# EasyEDA Pro project ProProject_BM3451[四串锂电池保护板]_2024-07-04.epro

# Schematic BM3415
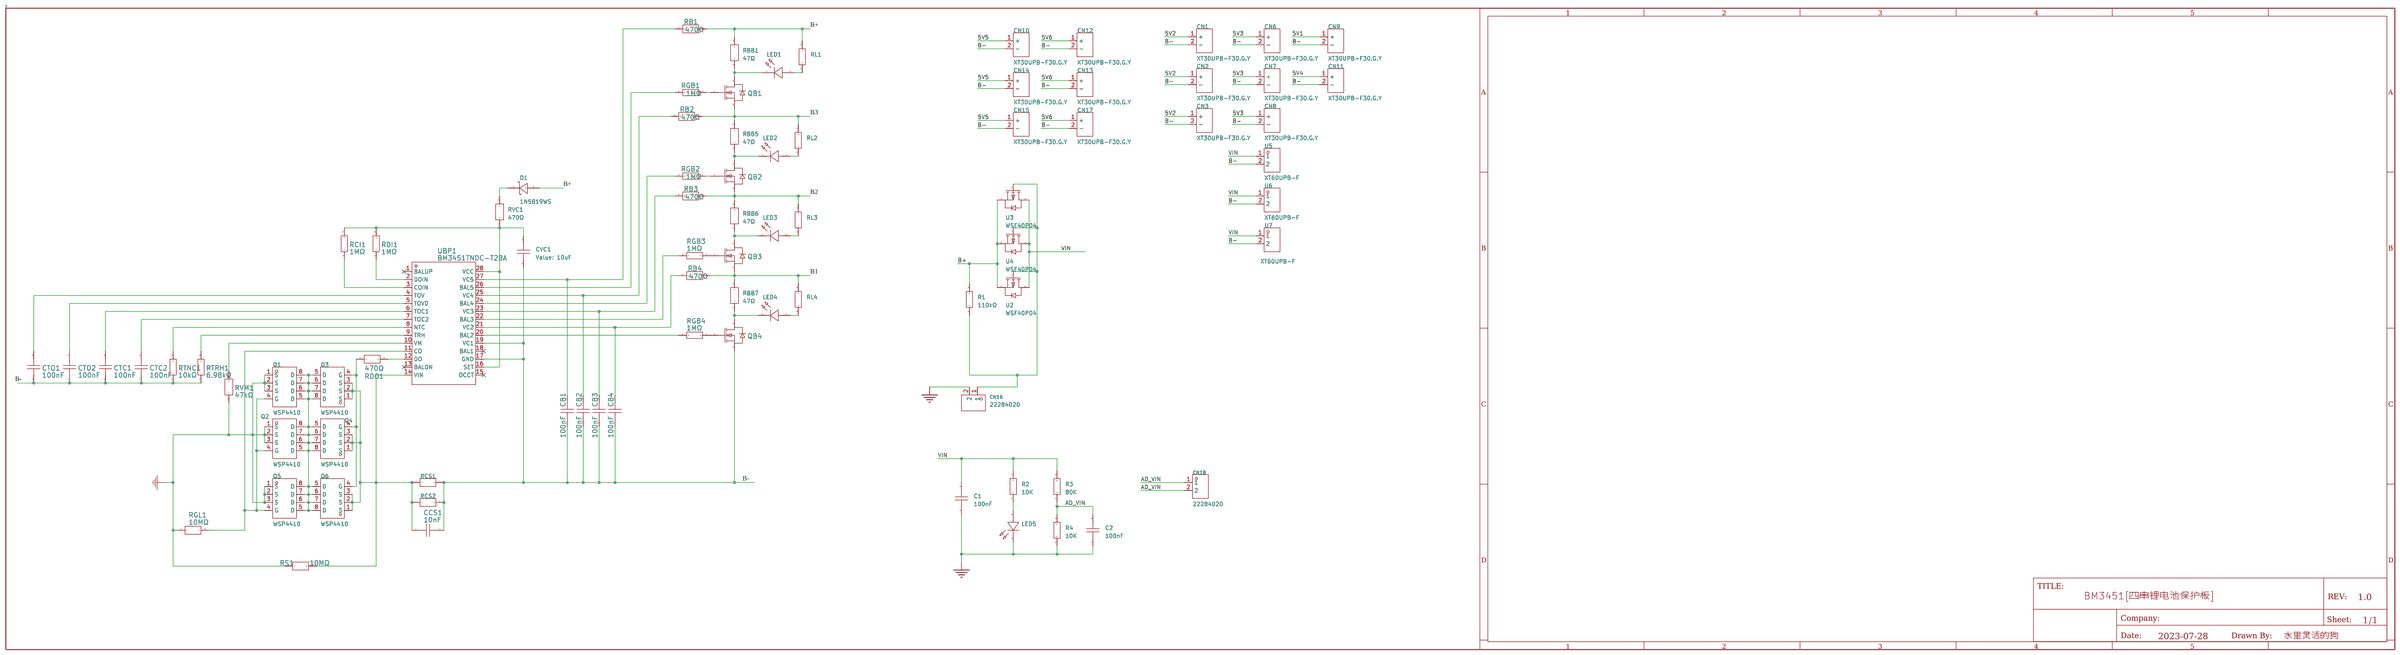
[diagram p0: schematic sheet]

## Parts
C1  100nF  [C0805]
C2  100nF  [C0805]
CB1  100nF  [C0805]
CB2  100nF  [C0805]
CB3  100nF  [C0805]
CB4  100nF  [C0805]
CCS1  10nF  [C0805]
CN1  XT30UPB-F30.G.Y  [CONN-TH_XT30UPB-F]
CN2  XT30UPB-F30.G.Y  [CONN-TH_XT30UPB-F]
CN3  XT30UPB-F30.G.Y  [CONN-TH_XT30UPB-F]
CN6  XT30UPB-F30.G.Y  [CONN-TH_XT30UPB-F]
CN7  XT30UPB-F30.G.Y  [CONN-TH_XT30UPB-F]
CN8  XT30UPB-F30.G.Y  [CONN-TH_XT30UPB-F]
CN9  XT30UPB-F30.G.Y  [CONN-TH_XT30UPB-F]
CN10  XT30UPB-F30.G.Y  [CONN-TH_XT30UPB-F]
CN11  XT30UPB-F30.G.Y  [CONN-TH_XT30UPB-F]
CN12  XT30UPB-F30.G.Y  [CONN-TH_XT30UPB-F]
CN13  XT30UPB-F30.G.Y  [CONN-TH_XT30UPB-F]
CN14  XT30UPB-F30.G.Y  [CONN-TH_XT30UPB-F]
CN15  XT30UPB-F30.G.Y  [CONN-TH_XT30UPB-F]
CN16  22284020  [HDR-TH_2P-P2.54-V-M-1]
CN17  XT30UPB-F30.G.Y  [CONN-TH_XT30UPB-F]
CN18  22284020  [HDR-TH_2P-P2.54-V-M-1]
CTC1  100nF  [C0805]
CTC2  100nF  [C0805]
CTO1  100nF  [C0805]
CTO2  100nF  [C0805]
CVC1  10uF  [C0805]
D1  1N5819WS  [SOD-323_L1.8-W1.3-LS2.5-RD]
LED1  XL-1005UGC  [LED0805-RD]
LED2  XL-1005UGC  [LED0805-RD]
LED3  XL-1005UGC  [LED0805-RD]
LED4  XL-1005UGC  [LED0805-RD]
LED5  XL-1005UGC  [LED0805-RD]
Q1  WSP4410  [SOIC-8_L4.9-W3.9-P1.27-LS6.0-BL]
Q2  WSP4410  [SOIC-8_L4.9-W3.9-P1.27-LS6.0-BL]
Q3  WSP4410  [SOIC-8_L4.9-W3.9-P1.27-LS6.0-BL]
Q4  WSP4410  [SOIC-8_L4.9-W3.9-P1.27-LS6.0-BL]
Q5  WSP4410  [SOIC-8_L4.9-W3.9-P1.27-LS6.0-BL]
Q6  WSP4410  [SOIC-8_L4.9-W3.9-P1.27-LS6.0-BL]
QB1  2N7002  [SOT-23-3_L2.9-W1.3-P1.90-LS2.4-BR]
QB2  2N7002  [SOT-23-3_L2.9-W1.3-P1.90-LS2.4-BR]
QB3  2N7002  [SOT-23-3_L2.9-W1.3-P1.90-LS2.4-BR]
QB4  2N7002  [SOT-23-3_L2.9-W1.3-P1.90-LS2.4-BR]
R1  110kΩ  [R0805]
R2  10K  [R0805]
R3  80K  [R0805]
R4  10K  [R0805]
RB1  470Ω  [R0805]
RB2  470Ω  [R0805]
RB3  470Ω  [R0805]
RB4  470Ω  [R0805]
RBB1  47Ω  [R2512]
RBB5  47Ω  [R2512]
RBB6  47Ω  [R2512]
RBB7  47Ω  [R2512]
RCI1  1MΩ  [R0805]
RCS1  5mΩ  [R2512]
RCS2  5mΩ  [R2512]
RDI1  1MΩ  [R0805]
RDO1  470Ω  [R0805]
RGB1  1MΩ  [R0805]
RGB2  1MΩ  [R0805]
RGB3  1MΩ  [R0805]
RGB4  1MΩ  [R0805]
RGL1  10MΩ  [R0805]
RL1  100Ω  [R0805]
RL2  100Ω  [R0805]
RL3  100Ω  [R0805]
RL4  100Ω  [R0805]
RS1  10MΩ  [R0805]
RTNC1  10kΩ  [R0805]
RTRH1  6.98kΩ  [R0805]
RVC1  470Ω  [R0805]
RVM1  47kΩ  [R0805]
U2  WSF40P04  [TO-252-3_L6.5-W5.8-P4.58-TL]
U3  WSF40P04  [TO-252-3_L6.5-W5.8-P4.58-TL]
U4  WSF40P04  [TO-252-3_L6.5-W5.8-P4.58-TL]
U5  XT60UPB-F  [CONN-TH_XT60UPB-F]
U6  XT60UPB-F  [CONN-TH_XT60UPB-F]
U7  XT60UPB-F  [CONN-TH_XT60UPB-F]
UBP1  BM3451TNDC-T28A  [TSSOP-28_L9.7-W4.4-P0.65-LS6.4-BL]  (no BOM)

## Library data of the parts
C1 C2 = CAP_0603: Supplier Footprint: 0603
CB1-CB4 CTC1 CTC2 CTO1 CTO2 = GRM155R71H104KE14D: 容值:100nF;精度:±10%;额定电压:50V;材质(温度系数):X7R;; LCSC Part Name: 100nF ±10% 50V; Supplier Part: C77020; Manufacturer: muRata(村田); Supplier Footprint: 0402; JLCPCB Part Class: Extended Part; Datasheet: https://atta.szlcsc.com/upload/public/pdf/source/20180326/C77020_39BD49C951FF1AF0DB1F1FAC5AC1E401.pdf; Supplier: LCSC; Tolerance: ±10%; Voltage Rated: 50V; Temperature Coefficient: X7R
CCS1 = C0402C103K4RECAUTO: 容值:10nF;精度:±10%;额定电压:16V;材质(温度系数):X7R;; LCSC Part Name: 10nF ±10% 16V; Supplier Part: C696351; Manufacturer: KEMET(基美); Supplier Footprint: 0402; JLCPCB Part Class: Extended Part; Datasheet: https://atta.szlcsc.com/upload/public/pdf/source/20200618/C599854_9A7AFD29568EF40FC359C8C28B3F53DB.pdf; Supplier: LCSC; Tolerance: ±10%; Voltage Rated: 16V; Temperature Coefficient: X7R
CN1-CN3 CN6-CN15 CN17 = XT30UPB-F30.G.Y: 类别:-;类型1:-;; LCSC Part Name: AMASS(艾迈斯)直立焊板式连接器XT30UPB30-F.G.*; Supplier Part: C108769; Manufacturer: AMASS(艾迈斯); JLCPCB Part Class: 扩展库; Datasheet: https://atta.szlcsc.com/upload/public/pdf/source/20220715/AFD68B9E8B6CA95A7295DBF4AF9325E4.pdf; Supplier: LCSC; Brand: 艾迈斯; Type: 航模插头; Colour: 黄色; RatedVoltage: DC 500V; InterfaceType: 母头; MetalMaterial: 镀金; InsulationMaterial: PA; RatedCurrent: 15A; contact resistance: 0.65mΩ
CN16 CN18 = 22284020: 排数:单排;总PIN位数:2;间距:2.54mm;插针结构:1x2P;行距:-;安装类型:直插;圆针/方针:方针;额定电流:-;额定电压:-;配合针长度:-;塑高:-;触头材质:黄铜;触头镀层:-;颜色:黑色;; LCSC Part Name: 2.54mm 1x2P 直插 方针; Supplier Part: C234182; Manufacturer: MOLEX; Supplier Footprint: 直插,P=2.54mm; JLCPCB Part Class: Extended Part; Supplier: LCSC; Number of Rows: 单排; Number of Pins: 2; Pitch: 2.54mm; Pin Structure: 1x2P; Mounting Type: 直插; Circluar Pins/Square Pins: 方针; Contact Material: 黄铜; Color: 黑色
CVC1 = GRM188R61E106KA73D: 容值:10uF;精度:±10%;额定电压:25V;材质(温度系数):X5R;; LCSC Part Name: 10uF ±10% 25V; Supplier Part: C344022; Manufacturer: muRata(村田); Supplier Footprint: 0603; JLCPCB Part Class: 扩展库; Datasheet: https://atta.szlcsc.com/upload/public/pdf/source/20181211/C344022_BB98D43E7DA95E5A749FBFE073C8A3E0.pdf; Supplier: LCSC; Tolerance: ±10%; Voltage Rated: 25V; Temperature Coefficient: X5R
D1 = 1N5819WS_C191023: 正向压降(Vf):600mV@1A;直流反向耐压(Vr):40V;平均整流电流(Io):1A;; LCSC Part Name: 电压:40V 电流:1A; Supplier Part: C191023; Manufacturer: Hottech(合科泰); Supplier Footprint: SOD-323; JLCPCB Part Class: 基础库; Datasheet: https://atta.szlcsc.com/upload/public/pdf/source/20220428/3CB86FD8D28D653594B4E35F9D5AEFD9.pdf; Supplier: LCSC; Forward Voltage (Vf@If): 600mV@1A; Reverse Voltage (Vr): 40V; Average Rectified Current (Io): 1A
LED1-LED5 = XL-1005UGC: 发光颜色:翠绿;主波长:516nm;色温:-;功率:80mW;安装方式:正贴;; LCSC Part Name: 正贴; Supplier Part: C2856703; Manufacturer: XINGLIGHT(成兴光); Supplier Footprint: 0402; JLCPCB Part Class: 扩展库; Datasheet: https://atta.szlcsc.com/upload/public/pdf/source/20221102/FF8D6BC2225363A60A01D46BB802F217.pdf; Supplier: LCSC; Emitted Color: 翠绿; Lens Color: 无色透明; Dominant Wavelength: 516nm; Peak Wavelength: 531nm; Forward Current: 25mA; Power Dissipation: 80mW; Viewing Angle: 120°; Mounting Sytle: 正贴; Operating Temperature: -30℃~+85℃
Q1-Q6 = WSP4410: 类型:1个N沟道;漏源电压(Vdss):30V;连续漏极电流(Id):20A;功率(Pd):4.2W;导通电阻(RDS(on)@Vgs,Id):5.5mΩ@10V,20A;阈值电压(Vgs(th)@Id):2.5V@250uA;; LCSC Part Name: 1个N沟道 耐压:30V 电流:20A; Supplier Part: C148401; Manufacturer: WINSOK(微硕); Supplier Footprint: SOIC-8; JLCPCB Part Class: 扩展库; Datasheet: https://atta.szlcsc.com/upload/public/pdf/source/20171122/C148401_15113334083791134046.pdf; Supplier: LCSC; Type: 1个N沟道; Drain Source Voltage (Vdss): 30V; Continuous Drain Current (Id): 20A; Power Dissipation (Pd): 4.2W; Drain Source On Resistance (RDS(on)@Vgs,Id): 5.5mΩ@10V,20A; Gate Threshold Voltage (Vgs(th)@Id): 2.5V@250uA
QB1-QB4 = 2N7002_C8545: 类型:N沟道;漏源电压(Vdss):60V;连续漏极电流(Id):115mA;功率(Pd):200mW;导通电阻(RDS(on)@Vgs,Id):7.5Ω@10V,500mA;阈值电压(Vgs(th)@Id):2.5V@250uA;; LCSC Part Name: N沟道 60V 115mA; Supplier Part: C8545; Manufacturer: CJ(江苏长电/长晶); Supplier Footprint: SOT-23; JLCPCB Part Class: Basic Part; Datasheet: https://atta.szlcsc.com/upload/public/pdf/source/20170302/1488422688078.pdf; Supplier: LCSC; Type: N沟道; Drain Source Voltage (Vdss): 60V; Continuous Drain Current (Id): 115mA; Power Dissipation (Pd): 200mW; Drain Source On Resistance (RDS(on)@Vgs,Id): 7.5Ω@10V,500mA; Gate Threshold Voltage (Vgs(th)@Id): 2.5V@250uA; image: //image.lceda.cn/szlcsc/C8545.jpg
R1 = 0805W8F5601T5E: 电阻类型:厚膜电阻;阻值:5.6kΩ;精度:±1%;功率:125mW;最大工作电压:150V;温度系数:±100ppm/℃;; LCSC Part Name: 5.6kΩ ±1% 125mW 厚膜电阻; Supplier Part: C4382; Manufacturer: UNI-ROYAL(厚声); Supplier Footprint: 0805; JLCPCB Part Class: 基础库; Datasheet: https://atta.szlcsc.com/upload/public/pdf/source/20200306/C422600_1E6D84923E4A46A82E41ADD87F860B5C.pdf; Supplier: LCSC; Type: 厚膜电阻; Tolerance: ±1%; Power(Watts): 125mW; Overload Voltage (Max): 150V; Temperature Coefficient: ±100ppm/℃; Operating Temperature Range: -55℃~+155℃
R2-R4 = Res_0603: Supplier Footprint: 0603
RB1-RB4 RDO1 = AC0402FR-07470RL: 电阻类型:厚膜电阻;阻值:470Ω;精度:±1%;功率:62.5mW;; LCSC Part Name: 470Ω ±1% 62.5mW; Supplier Part: C227095; Manufacturer: YAGEO(国巨); Supplier Footprint: 0402; JLCPCB Part Class: Extended Part; Supplier: LCSC; Type: 厚膜电阻; Tolerance: ±1%; Power(Watts): 62.5mW; Temperature Coefficient: ±100ppm/℃; Overload Voltage (Max): 50V; Operating Temperature Range: -55℃~+155℃
RBB1 RBB5-RBB7 = RC-12K47R0FT: 阻值:47Ω;精度:±1%;功率:1W;; LCSC Part Name: 47Ω ±1% 1W; Supplier Part: C454019; Manufacturer: FH(风华); Supplier Footprint: 2512; JLCPCB Part Class: 扩展库; Datasheet: https://atta.szlcsc.com/upload/public/pdf/source/20191118/C454019_423B00CEBAB54B2627AFCDB1F4844184.pdf; Supplier: LCSC; Tolerance: ±1%; Power(Watts): 1W; Temperature Coefficient: ±100ppm/℃; Overload Voltage (Max): 200V; Operating Temperature Range: -55℃~+155℃
RCI1 RDI1 RGB1-RGB4 = RMC04021M1%N: 阻值:1MΩ;精度:±1%;功率:62.5mW;; LCSC Part Name: 1MΩ ±1% 62.5mW; Supplier Part: C269676; Manufacturer: Tyohm(幸亚电阻); Supplier Footprint: 0402; JLCPCB Part Class: Extended Part; Datasheet: https://atta.szlcsc.com/upload/public/pdf/source/20190115/C269676_B2C26B8F3189207BFE78006A6224644A.pdf; Supplier: LCSC; Tolerance: ±1%; Power(Watts): 62.5mW
RCS1 RCS2 = RLP25FEGR010: 阻值:10mΩ;精度:±1%;功率:3W;; LCSC Part Name: 10mΩ ±1% 3W; Supplier Part: C393070; Manufacturer: 大毅科技; Supplier Footprint: 2512; JLCPCB Part Class: 扩展库; Datasheet: https://atta.szlcsc.com/upload/public/pdf/source/20190614/C393070_2745FAF1A0F67D16246ACC5358362128.pdf; Supplier: LCSC; Tolerance: ±1%; Power(Watts): 3W; Temperature Coefficient: ±50ppm/℃
RGL1 RS1 = CQ02WGF1005TCE: 阻值:10MΩ;精度:±1%;功率:62.5mW;; LCSC Part Name: 10MΩ ±1% 62.5mW; Supplier Part: C966881; Manufacturer: UNI-ROYAL(厚声); Supplier Footprint: 0402; JLCPCB Part Class: Extended Part; Datasheet: https://atta.szlcsc.com/upload/public/pdf/source/20191220/C473620_6C11B82F3C06B184C34B0BC4B16C3771.pdf; Supplier: LCSC; Tolerance: ±1%; Power(Watts): 62.5mW; Temperature Coefficient: ±100ppm/℃
RL1-RL4 = 0402WGF1000TCE: 电阻类型:厚膜电阻;阻值:100Ω;精度:±1%;功率:62.5mW;; LCSC Part Name: 100Ω ±1% 62.5mW; Supplier Part: C25076; Manufacturer: UNI-ROYAL(厚声); Supplier Footprint: 0402; JLCPCB Part Class: 基础库; Datasheet: https://atta.szlcsc.com/upload/public/pdf/source/20200306/C422600_1E6D84923E4A46A82E41ADD87F860B5C.pdf; Supplier: LCSC; Type: 厚膜电阻; Tolerance: ±1%; Power(Watts): 62.5mW; Temperature Coefficient: ±200ppm/℃; Overload Voltage (Max): 50V; Operating Temperature Range: -55℃~+155℃
RTNC1 = HQ02WAJ0103TCE: 阻值:10kΩ;精度:±5%;功率:100mW;; LCSC Part Name: 10kΩ ±5% 100mW; Supplier Part: C414854; Manufacturer: UNI-ROYAL(厚声); Supplier Footprint: 0402; JLCPCB Part Class: Extended Part; Datasheet: https://atta.szlcsc.com/upload/public/pdf/source/20190827/C414854_F9DF8C7611D3E333A8C36E68C956CEBE.pdf; Supplier: LCSC; Tolerance: ±5%; Power(Watts): 100mW; Temperature Coefficient: ±100ppm/℃; Overload Voltage (Max): 50V; Operating Temperature Range: -55℃~+155℃
RTRH1 = 0402WGF6981TCE: 电阻类型:厚膜电阻;阻值:6.98kΩ;精度:±1%;功率:62.5mW;; LCSC Part Name: 6.98kΩ ±1% 62.5mW; Supplier Part: C47500; Manufacturer: UNI-ROYAL(厚声); Supplier Footprint: 0402; JLCPCB Part Class: Extended Part; Datasheet: https://atta.szlcsc.com/upload/public/pdf/source/20200306/C422600_1E6D84923E4A46A82E41ADD87F860B5C.pdf; Supplier: LCSC; Type: 厚膜电阻; Tolerance: ±1%; Power(Watts): 62.5mW; Temperature Coefficient: ±100ppm/℃; Overload Voltage (Max): 50V; Operating Temperature Range: -55℃~+155℃
RVC1 = AC0402FR-07470RL: 电阻类型:厚膜电阻;阻值:470Ω;精度:±1%;功率:62.5mW;; LCSC Part Name: 470Ω ±1% 62.5mW; Supplier Part: C227095; Manufacturer: YAGEO(国巨); Supplier Footprint: 0402; JLCPCB Part Class: 扩展库; Supplier: LCSC; Type: 厚膜电阻; Tolerance: ±1%; Power(Watts): 62.5mW; Temperature Coefficient: ±100ppm/℃; Overload Voltage (Max): 50V; Operating Temperature Range: -55℃~+155℃
RVM1 = SY0402FN47KP: 电阻类型:厚膜电阻;阻值:47kΩ;精度:±1%;功率:62.5mW;; LCSC Part Name: 47kΩ ±1% 62.5mW; Supplier Part: C380741; Manufacturer: SANYEAR(叁叶源); Supplier Footprint: 0402; JLCPCB Part Class: Extended Part; Datasheet: https://atta.szlcsc.com/upload/public/pdf/source/20190402/C380741_8CF2CE0335C9F0AD9BB6891F24649840.pdf; Supplier: LCSC; Type: 厚膜电阻; Tolerance: ±1%; Power(Watts): 62.5mW; Temperature Coefficient: ±100ppm/℃; Overload Voltage (Max): 50V
U2-U4 = WSF40P04: 类型:P沟道;漏源电压(Vdss):40V;连续漏极电流(Id):20A;功率(Pd):45W;导通电阻(RDS(on)@Vgs,Id):42mΩ@10V,12A;阈值电压(Vgs(th)@Id):3V@250uA;; LCSC Part Name: P沟道 耐压:40V 电流:20A; Supplier Part: C377856; Manufacturer: WINSOK(微硕); Supplier Footprint: TO-252; JLCPCB Part Class: 扩展库; Datasheet: https://atta.szlcsc.com/upload/public/pdf/source/20190402/C377856_EA6D580CFC75EC1A86C76F055758242D.pdf; Supplier: LCSC; Type: P沟道; Drain Source Voltage (Vdss): 40V; Continuous Drain Current (Id): 20A; Power Dissipation (Pd): 45W; Drain Source On Resistance (RDS(on)@Vgs,Id): 42mΩ@10V,12A; Gate Threshold Voltage (Vgs(th)@Id): 3V@250uA
U5-U7 = XT60UPB-F: Supplier Part: C9900007500; Supplier Footprint: 插件; JLCPCB Part Class: 扩展库; Supplier: LCSC
UBP1 = BM3451UNDC-T28A: 充电电池的类型:-;电池单元组数:-;最大充电电流:-;充满的电池组电压:-;最大供应电压:-;; Supplier Part: C94597; Supplier Footprint: TSSOP-28; JLCPCB Part Class: Extended Part; Datasheet: https://atta.szlcsc.com/upload/public/pdf/source/20170417/1492393727246.pdf; Supplier: LCSC

## Nets
5V1: CN9.1(+)
5V2: CN1.1(+) CN2.1(+) CN3.1(+)
5V3: CN6.1(+) CN7.1(+) CN8.1(+)
5V4: CN11.1(+)
5V5: CN10.1(+) CN14.1(+) CN15.1(+)
5V6: CN12.1(+) CN13.1(+) CN17.1(+)
GND: CN16.2 Q1.1(S) Q1.2(S) Q1.3(S) Q2.1(S) Q2.2(S) Q2.3(S) Q5.1(S) Q5.2(S) Q5.3(S) RGL1.1 RS1.1 RVM1.1
VIN: C1.2 R2.2 R3.2 U2.2(D) U3.2(D) U4.2(D) U5.1 U6.1 U7.1
AD_VIN: C2.2 CN18.1 CN18.2 R3.1 R4.2
B1: QB3.2(S) RB4.1 RBB7.2 RL4.2
B2: QB2.2(S) RB3.1 RBB6.2 RL3.2
B3: QB1.2(S) RB2.1 RBB5.2 RL2.2
B+: D1.2(A) R1.2 RB1.1 RBB1.2 RL1.2 U2.3(S) U3.3(S) U4.3(S)
B-: C1.1 C2.1 CB1.1 CB2.1 CB3.1 CB4.1 CCS1.2 CN1.2(-) CN2.2(-) CN3.2(-) CN6.2(-) CN7.2(-) CN8.2(-) CN9.2(-) CN10.2(-) CN11.2(-) CN12.2(-) CN13.2(-) CN14.2(-) CN15.2(-) CN17.2(-) CTC1.2 CTC2.1 CTO1.1 CTO2.1 CVC1.2 LED5.1(K) QB4.2(S) R4.1 RCS1.2 RCS2.2 RTNC1.1 RTRH1.1 U5.2 U6.2 U7.2 UBP1.17(GND) UBP1.19(VC1)
$1N37: RTRH1.2 UBP1.9(TRH)
$1N38: RVM1.2 UBP1.10(VM)
$1N41: RCI1.1 UBP1.3(COIN)
$1N42: RDI1.1 UBP1.2(DOIN)
$1N54: RGB4.2 UBP1.20(BAL2)
$1N55: CB4.2 RB4.2 UBP1.21(VC2)
$1N56: RGB3.2 UBP1.22(BAL3)
$1N57: CB3.2 RB3.2 UBP1.23(VC3)
$1N58: RGB2.2 UBP1.24(BAL4)
$1N59: CB2.2 RB2.2 UBP1.25(VC4)
$1N60: RGB1.2 UBP1.26(BAL5)
$1N61: CB1.2 RB1.2 UBP1.27(VC5)
$1N66: RTNC1.2 UBP1.8(NTC)
$1N105: CTO2.2 UBP1.5(TOVD)
$1N106: CTO1.2 UBP1.4(TOV)
$1N117: CTC1.1 UBP1.6(TOC1)
$1N128: CTC2.2 UBP1.7(TOC2)
$1N197: RDO1.1 UBP1.12(DO)
$1N523: QB4.1(G) RGB4.1
$1N524: QB3.1(G) RGB3.1
$1N525: QB1.1(G) RGB1.1
$1N526: QB2.1(G) RGB2.1
$1N12807: D1.1(K) RVC1.2
$1N12811: CVC1.1 RCI1.2 RDI1.2 RVC1.1 UBP1.16(SET) UBP1.28(VCC)
$1N14828: LED3.2(A) RL3.1
$1N14831: LED3.1(K) QB3.3(D) RBB6.1
$1N14846: LED4.2(A) RL4.1
$1N14849: LED4.1(K) QB4.3(D) RBB7.1
$1N14873: LED2.2(A) RL2.1
$1N14876: LED2.1(K) QB2.3(D) RBB5.1
$1N14882: LED1.2(A) RL1.1
$1N14886: LED1.1(K) QB1.3(D) RBB1.1
$1N21594: Q1.5(D) Q1.6(D) Q1.7(D) Q1.8(D) Q2.5(D) Q2.6(D) Q2.7(D) Q2.8(D) Q3.5(D) Q3.6(D) Q3.7(D) Q3.8(D) Q4.5(D) Q4.6(D) Q4.7(D) Q4.8(D) Q5.5(D) Q5.6(D) Q5.7(D) Q5.8(D) Q6.5(D) Q6.6(D) Q6.7(D) Q6.8(D)
$1N21831: Q3.4(G) Q4.4(G) Q6.4(G) RDO1.2
$1N21844: CCS1.1 Q3.1(S) Q3.2(S) Q3.3(S) Q4.1(S) Q4.2(S) Q4.3(S) Q6.1(S) Q6.2(S) Q6.3(S) RCS1.1 RCS2.1 RS1.2 UBP1.14(VIN)
$1N22030: Q1.4(G) Q2.4(G) Q5.4(G) RGL1.2 UBP1.11(CO)
$1N23729: CN16.1 R1.1 U2.1(G) U3.1(G) U4.1(G)
$1N34990: LED5.2(A) R2.1

Not connected (* = marked no-connect by the designer): UBP1 1(BALUP)* 13(BALDN)* 15(OCCT)* 18(BAL1)*

# Board BM3415
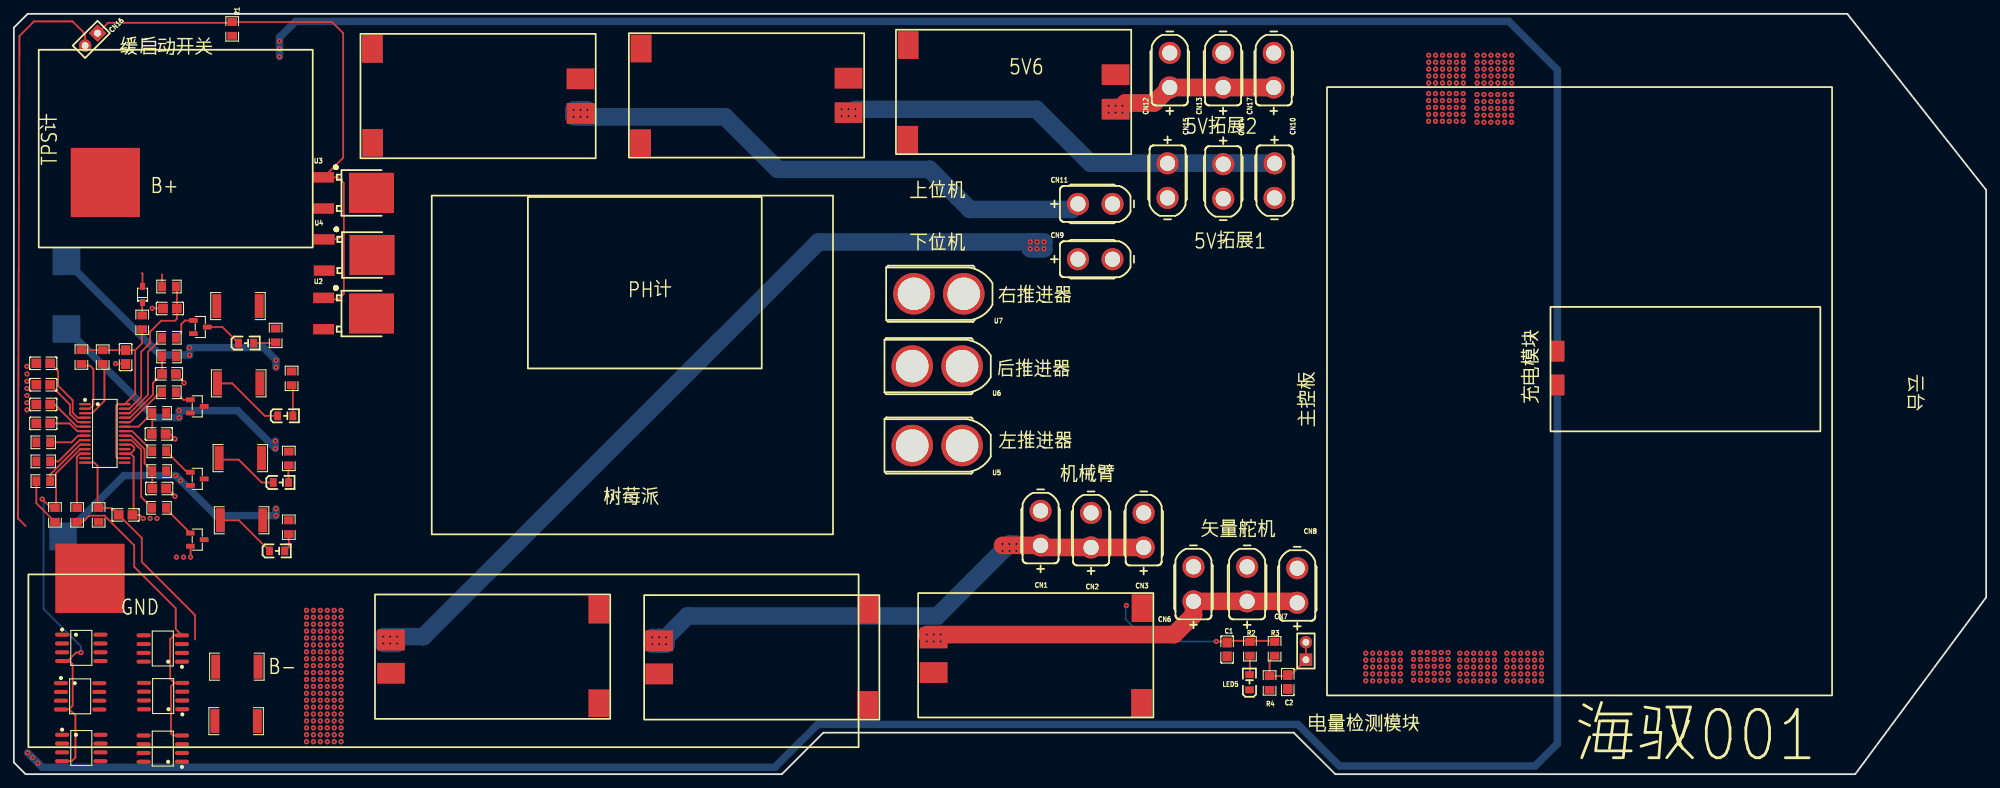
[diagram p1: board, top side]
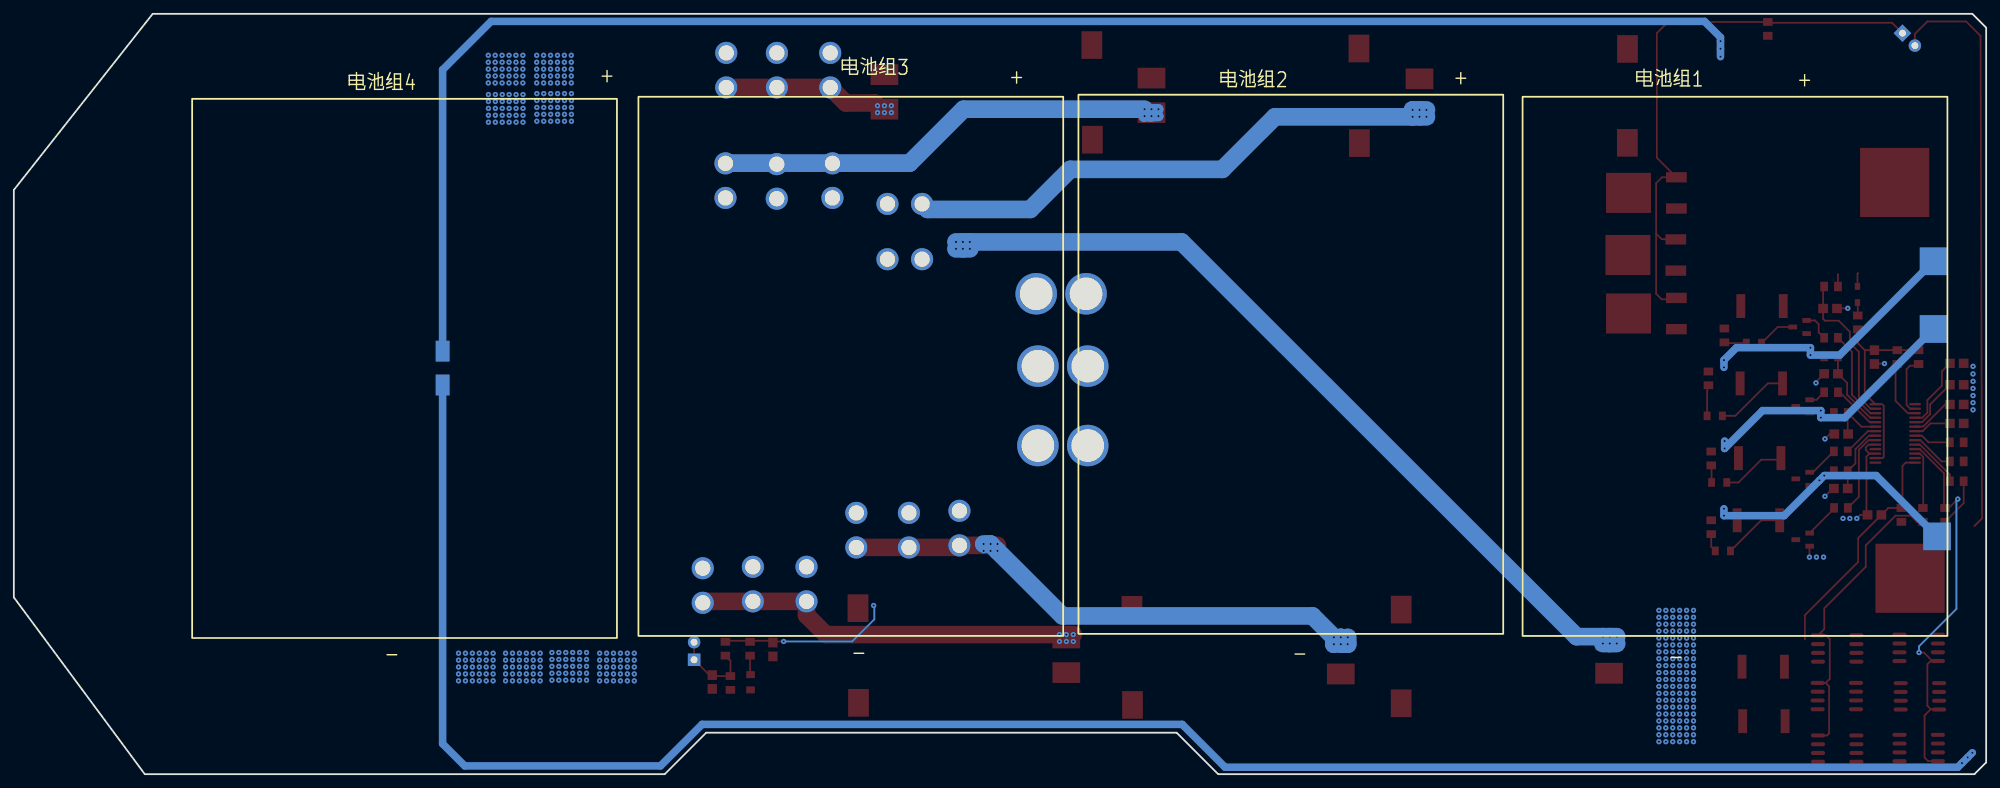
[diagram p2: board, bottom side, seen from below]

Outline 285.07 x 110 mm; copper layers: Top Layer, Bottom Layer. Coordinates in mm from the lower left corner of the outline.
Outline path: 0,108 0,1.7 1.7,0 111,0 117,6 185,6 191,0 266.14,0 285.07,25.59 285.07,84.52 265,110 2,110 0,108
Stack: Top Layer 0.035mm / Dielectric1 1.51mm FR4 er 4.5 / Bottom Layer 0.035mm

## Design rules (mm)
template: 自定义配置
spacing copperThickness1oz (default): track to track 0.102, other pairs 0.152 to 0.3
spacing copperThickness2oz: track to track 0.203, other pairs 0.152 to 0.3
track width copperThickness1oz (default): min 0.127, default 0.254, max 2.54
track width copperThickness2oz: min 0.203, default 0.254, max 2.54
differential pair differentialPair (default): width min 0.127, default 0.254, max 2.54; gap min 0.152, default 0.152
via viaSize (default): diameter min 0.5, default 0.61, max 10; hole min 0.3, default 0.305, max 6.3

## Placement (name value [footprint] x y rotation side)
C1  100nF  [C0805]  175.36 18.04 90 top
C2  100nF  [C0805]  184.12 13.33 90 top
CB1  100nF  [C0805]  22.56 67.37 0 top
CB2  100nF  [C0805]  22.42 57.92 180 top
CB3  100nF  [C0805]  20.95 49.22 180 top
CB4  100nF  [C0805]  21.01 41.33 180 top
CCS1  10nF  [C0805]  16.15 37.51 0 top
CN1  XT30UPB-F30.G.Y  [CONN-TH_XT30UPB-F]  148.4 35.6 90 top
CN2  XT30UPB-F30.G.Y  [CONN-TH_XT30UPB-F]  155.7 35.3 90 top
CN3  XT30UPB-F30.G.Y  [CONN-TH_XT30UPB-F]  163.3 35.3 90 top
CN6  XT30UPB-F30.G.Y  [CONN-TH_XT30UPB-F]  170.5 27.5 90 top
CN7  XT30UPB-F30.G.Y  [CONN-TH_XT30UPB-F]  178.25 27.5 90 top
CN8  XT30UPB-F30.G.Y  [CONN-TH_XT30UPB-F]  185.5 27.29 90 top
CN9  XT30UPB-F30.G.Y  [CONN-TH_XT30UPB-F]  156.3 74.5 0 top
CN10  XT30UPB-F30.G.Y  [CONN-TH_XT30UPB-F]  182.21 85.87 270 top
CN11  XT30UPB-F30.G.Y  [CONN-TH_XT30UPB-F]  156.3 82.5 0 top
CN12  XT30UPB-F30.G.Y  [CONN-TH_XT30UPB-F]  167.07 101.85 90 top
CN13  XT30UPB-F30.G.Y  [CONN-TH_XT30UPB-F]  174.78 101.85 90 top
CN14  XT30UPB-F30.G.Y  [CONN-TH_XT30UPB-F]  174.8 85.75 270 top
CN15  XT30UPB-F30.G.Y  [CONN-TH_XT30UPB-F]  166.75 85.87 270 top
CN16  22284020  [HDR-TH_2P-P2.54-V-M-1]  11.2 106.3 225 top
CN17  XT30UPB-F30.G.Y  [CONN-TH_XT30UPB-F]  182.1 101.85 90 top
CN18  22284020  [HDR-TH_2P-P2.54-V-M-1]  186.75 17.82 90 top
CTC1  100nF  [C0805]  4.25 53.49 180 top
CTC2  100nF  [C0805]  4.25 50.75 0 top
CTO1  100nF  [C0805]  4.25 59.44 0 top
CTO2  100nF  [C0805]  4.25 56.34 0 top
CVC1  10uF  [C0805]  16.15 60.34 270 top
D1  1N5819WS  [SOD-323_L1.8-W1.3-LS2.5-RD]  18.6 69.4 90 top
LED1  XL-1005UGC  [LED0805-RD]  33.56 62.36 0 top
LED2  XL-1005UGC  [LED0805-RD]  39.23 51.84 0 top
LED3  XL-1005UGC  [LED0805-RD]  38.59 42.2 0 top
LED4  XL-1005UGC  [LED0805-RD]  38.05 32.3 0 top
LED5  XL-1005UGC  [LED0805-RD]  178.59 13.3 90 top
NOREF  -  [Pad_e281]  93.28 19.3 90 top
NOREF#2  -  [Pad_e287]  163.06 24.01 0 top
NOREF#3  -  [Pad_e286]  132.95 14.7 90 top
NOREF#4  -  [Pad_e302]  7.6 74.2 90 top
NOREF#5  -  [Pad_e305]  7.6 64.4 90 top
NOREF#6  -  [Pad_e266]  51.86 91.33 0 top
NOREF#7  -  [Pad_e288]  162.99 10.32 0 top
NOREF#8  -  [Pad_e269]  81.9 95.6 90 top
NOREF#9  -  [Pad_e275]  120.64 100.7 90 top
NOREF#10  -  [Pad_e84]  129.19 91.79 0 top
NOREF#11  -  [Pad_e270]  90.66 104.98 0 top
NOREF#12  -  [Pad_e278]  54.51 14.6 90 top
NOREF#13  -  [Pad_e300]  13.22 85.6 90 top
NOREF#14  -  [Pad_e277]  54.51 19.4 90 top
NOREF#15  -  [Pad_e285]  132.95 19.7 90 top
NOREF#16  -  [Pad_e283]  123.46 23.78 0 top
NOREF#17  -  [Pad_e299]  11 28.33 90 top
NOREF#18  -  [Pad_e279]  84.55 23.81 0 top
NOREF#19  -  [Pad_e274]  90.59 91.29 0 top
NOREF#20  -  [Pad_e4]  223.1 61.2 0 top
NOREF#21  -  [Pad_e40]  159.24 96.2 90 top
NOREF#22  -  [Pad_e6]  223.1 56.3 0 top
NOREF#23  -  [Pad_e267]  81.9 100.6 270 top
NOREF#24  -  [Pad_e49]  159.24 101.2 90 top
NOREF#25  -  [Pad_e282]  93.28 14.5 90 top
NOREF#26  -  [Pad_e280]  84.55 10.26 0 top
NOREF#27  -  [Pad_e81]  129.26 105.48 0 top
NOREF#28  -  [Pad_e260]  51.84 104.92 0 top
NOREF#29  -  [Pad_e308]  7.1 34.4 90 top
NOREF#30  -  [Pad_e276]  120.64 95.7 90 top
NOREF#31  -  [Pad_e284]  123.39 10.02 0 top
Q1  WSP4410  [SOIC-8_L4.9-W3.9-P1.27-LS6.0-BL]  9.58 11.26 270 top
Q2  WSP4410  [SOIC-8_L4.9-W3.9-P1.27-LS6.0-BL]  9.75 18.27 270 top
Q3  WSP4410  [SOIC-8_L4.9-W3.9-P1.27-LS6.0-BL]  21.53 18.18 90 top
Q4  WSP4410  [SOIC-8_L4.9-W3.9-P1.27-LS6.0-BL]  21.58 11.3 90 top
Q5  WSP4410  [SOIC-8_L4.9-W3.9-P1.27-LS6.0-BL]  9.75 3.79 270 top
Q6  WSP4410  [SOIC-8_L4.9-W3.9-P1.27-LS6.0-BL]  21.53 3.7 90 top
QB1  2N7002  [SOT-23-3_L2.9-W1.3-P1.90-LS2.4-BR]  26.95 64.69 180 top
QB2  2N7002  [SOT-23-3_L2.9-W1.3-P1.90-LS2.4-BR]  26.51 53.21 180 top
QB3  2N7002  [SOT-23-3_L2.9-W1.3-P1.90-LS2.4-BR]  26.51 42.73 180 top
QB4  2N7002  [SOT-23-3_L2.9-W1.3-P1.90-LS2.4-BR]  26.51 33.93 180 top
R1  110kΩ  [R0805]  31.56 107.82 270 top
R2  10K  [R0805]  178.66 18.14 90 top
R3  80K  [R0805]  182.22 18.14 90 top
R4  10K  [R0805]  181.5 13.19 90 top
RB1  470Ω  [R0805]  22.42 70.55 0 top
RB2  470Ω  [R0805]  22.42 60.43 180 top
RB3  470Ω  [R0805]  21.01 52.26 180 top
RB4  470Ω  [R0805]  21.01 43.85 180 top
RBB1  47Ω  [R2512]  32.4 67.72 0 top
RBB5  47Ω  [R2512]  32.5 56.54 0 top
RBB6  47Ω  [R2512]  32.74 45.72 0 top
RBB7  47Ω  [R2512]  32.92 36.73 0 top
RCI1  1MΩ  [R0805]  12.84 60.34 90 top
RCS1  5mΩ  [R2512]  32.23 15.55 0 top
RCS2  5mΩ  [R2512]  32.13 7.67 0 top
RDI1  1MΩ  [R0805]  9.77 60.34 90 top
RDO1  470Ω  [R0805]  9.15 37.51 270 top
RGB1  1MΩ  [R0805]  22.42 63.13 180 top
RGB2  1MΩ  [R0805]  22.42 55.25 180 top
RGB3  1MΩ  [R0805]  21.01 46.71 180 top
RGB4  1MΩ  [R0805]  20.99 38.53 180 top
RGL1  10MΩ  [R0805]  5.94 37.51 90 top
RL1  100Ω  [R0805]  37.84 63.47 90 top
RL2  100Ω  [R0805]  40.14 57.26 90 top
RL3  100Ω  [R0805]  39.74 45.68 90 top
RL4  100Ω  [R0805]  39.74 35.73 90 top
RS1  10MΩ  [R0805]  12.26 37.51 90 top
RTNC1  10kΩ  [R0805]  4.25 48.01 0 top
RTRH1  6.98kΩ  [R0805]  4.25 45.25 0 top
RVC1  470Ω  [R0805]  18.55 65.36 90 top
RVM1  47kΩ  [R0805]  4.25 42.39 0 top
U2  WSF40P04  [TO-252-3_L6.5-W5.8-P4.58-TL]  48.23 66.64 0 top
U3  WSF40P04  [TO-252-3_L6.5-W5.8-P4.58-TL]  48.23 84.09 0 top
U4  WSF40P04  [TO-252-3_L6.5-W5.8-P4.58-TL]  48.32 75.11 0 top
U5  XT60UPB-F  [CONN-TH_XT60UPB-F]  133.45 47.54 180 top
U6  XT60UPB-F  [CONN-TH_XT60UPB-F]  133.45 59.03 180 top
U7  XT60UPB-F  [CONN-TH_XT60UPB-F]  133.7 69.5 180 top
UBP1  BM3451TNDC-T28A  [TSSOP-28_L9.7-W4.4-P0.65-LS6.4-BL]  13.15 49.3 270 top

## Footprints (pads in the part's own frame, mm; a bottom-side part is the same pattern mirrored in y, then rotated)
C0805
  rect 1.41x1.35 smd: 1(-1,0) 2(1,0)
CONN-TH_XT30UPB-F
  round 3.2 hole 2.2: 1(-2.5,0) 2(2.5,0)
CONN-TH_XT60UPB-F
  round 6 hole 4.7: 1(3.6,0) 2(-3.6,0)
HDR-TH_2P-P2.54-V-M-1
  rect 1.8x1.8 hole 1: 1(-1.27,0)
  round 1.8 hole 1: 2(1.27,0)
LED0805-RD
  rect 1x1.25 smd: 1(-1.1,0) 2(1.1,0)
Pad_e4
  rect 2x3 hole 0.003: 31(0,0)
Pad_e6
  rect 2x3 hole 0.003: 32(0,0)
Pad_e40
  rect 3x4 smd: 1(0,0)
Pad_e49
  rect 3x4 smd: 1(0,0)
Pad_e81
  rect 3x4 smd: 1(0,0)
Pad_e84
  rect 3x4 smd: 1(0,0)
Pad_e260
  rect 3x4 smd: 1(0,0)
Pad_e266
  rect 3x4 smd: 1(0,0)
Pad_e267
  rect 3x4 smd: 1(0,0)
Pad_e269
  rect 3x4 smd: 1(0,0)
Pad_e270
  rect 3x4 smd: 1(0,0)
Pad_e274
  rect 3x4 smd: 1(0,0)
Pad_e275
  rect 3x4 smd: 1(0,0)
Pad_e276
  rect 3x4 smd: 1(0,0)
Pad_e277
  rect 3x4 smd: 1(0,0)
Pad_e278
  rect 3x4 smd: 1(0,0)
Pad_e279
  rect 3x4 smd: 1(0,0)
Pad_e280
  rect 3x4 smd: 1(0,0)
Pad_e281
  rect 3x4 smd: 1(0,0)
Pad_e282
  rect 3x4 smd: 1(0,0)
Pad_e283
  rect 3x4 smd: 1(0,0)
Pad_e284
  rect 3x4 smd: 1(0,0)
Pad_e285
  rect 3x4 smd: 1(0,0)
Pad_e286
  rect 3x4 smd: 1(0,0)
Pad_e287
  rect 3x4 smd: 1(0,0)
Pad_e288
  rect 3x4 smd: 1(0,0)
Pad_e299
  rect 10x10 smd: 2(0,0)
Pad_e300
  rect 10x10 smd: 3(0,0)
Pad_e302
  rect 4x4 smd far side: 4(0,0)
Pad_e305
  rect 4x4 smd far side: 29(0,0)
Pad_e308
  rect 4x4 smd far side: 30(0,0)
R0805
  rect 1.133x1.377 smd: 1(-1,0) 2(1,0)
R2512
  rect 1.282x3.456 smd: 1(-3.067,0) 2(3.067,0)
SOD-323_L1.8-W1.3-LS2.5-RD
  rect 1x0.75 smd: 1(-1.173,0) 2(1.173,0)
SOIC-8_L4.9-W3.9-P1.27-LS6.0-BL
  oval 0.588x2.045 smd: 1(-1.905,-2.772) 2(-0.635,-2.772) 3(0.635,-2.772) 4(1.905,-2.772) 5(1.905,2.772) 6(0.635,2.772) 7(-0.635,2.772) 8(-1.905,2.772)
SOT-23-3_L2.9-W1.3-P1.90-LS2.4-BR
  rect 1.25x0.7 smd: 1(1,-0.95) 2(1,0.95) 3(-1,0)
TO-252-3_L6.5-W5.8-P4.58-TL
  rect 3x1.5 smd: 1(-3.457,2.26) 3(-3.457,-2.26)
  rect 6.5x5.8 smd: 2(3.457,0)
TSSOP-28_L9.7-W4.4-P0.65-LS6.4-BL
  oval 0.343x1.732 smd: 1(-4.225,-2.866) 2(-3.575,-2.866) 3(-2.925,-2.866) 4(-2.275,-2.866) 5(-1.625,-2.866) 6(-0.975,-2.866) 7(-0.325,-2.866) 8(0.325,-2.866) 9(0.975,-2.866) 10(1.625,-2.866) 11(2.275,-2.866) 12(2.925,-2.866) 13(3.575,-2.866) 14(4.225,-2.866) 15(4.225,2.866) 16(3.575,2.866) 17(2.925,2.866) 18(2.275,2.866) 19(1.625,2.866) 20(0.975,2.866) 21(0.325,2.866) 22(-0.325,2.866) 23(-0.975,2.866) 24(-1.625,2.866) 25(-2.275,2.866) 26(-2.925,2.866) 27(-3.575,2.866) 28(-4.225,2.866)

## Nets
5V1: CN9.1 NOREF#14.1
5V2: CN1.1 CN2.1 CN3.1 NOREF.1
5V3: CN6.1 CN7.1 CN8.1 NOREF#15.1
5V4: CN11.1 NOREF#8.1
5V5: CN10.1 CN14.1 CN15.1 NOREF#30.1
5V6: CN12.1 CN13.1 CN17.1 NOREF#21.1
GND: CN16.2 NOREF#17.2 NOREF#22.32 Q1.1 Q1.2 Q1.3 Q2.1 Q2.2 Q2.3 Q5.1 Q5.2 Q5.3 RGL1.1 RS1.1 RVM1.1
VIN: C1.2 NOREF#2.1 NOREF#6.1 NOREF#10.1 NOREF#16.1 NOREF#18.1 NOREF#19.1 R2.2 R3.2 U2.2 U3.2 U4.2 U5.1 U6.1 U7.1
AD_VIN: C2.2 CN18.1 CN18.2 R3.1 R4.2
B1: NOREF#29.30 QB3.2 RB4.1 RBB7.2 RL4.2
B2: NOREF#5.29 QB2.2 RB3.1 RBB6.2 RL3.2
B3: NOREF#4.4 QB1.2 RB2.1 RBB5.2 RL2.2
B+: D1.2 NOREF#13.3 NOREF#20.31 R1.2 RB1.1 RBB1.2 RL1.2 U2.3 U3.3 U4.3
B-: C1.1 C2.1 CB1.1 CB2.1 CB3.1 CB4.1 CCS1.2 CN1.2 CN2.2 CN3.2 CN6.2 CN7.2 CN8.2 CN9.2 CN10.2 CN11.2 CN12.2 CN13.2 CN14.2 CN15.2 CN17.2 CTC1.2 CTC2.1 CTO1.1 CTO2.1 CVC1.2 LED5.1 NOREF#3.1 NOREF#7.1 NOREF#9.1 NOREF#11.1 NOREF#12.1 NOREF#23.1 NOREF#24.1 NOREF#25.1 NOREF#26.1 NOREF#27.1 NOREF#28.1 NOREF#31.1 QB4.2 R4.1 RCS1.2 RCS2.2 RTNC1.1 RTRH1.1 U5.2 U6.2 U7.2 UBP1.17 UBP1.19
$1N37: RTRH1.2 UBP1.9
$1N38: RVM1.2 UBP1.10
$1N41: RCI1.1 UBP1.3
$1N42: RDI1.1 UBP1.2
$1N54: RGB4.2 UBP1.20
$1N55: CB4.2 RB4.2 UBP1.21
$1N56: RGB3.2 UBP1.22
$1N57: CB3.2 RB3.2 UBP1.23
$1N58: RGB2.2 UBP1.24
$1N59: CB2.2 RB2.2 UBP1.25
$1N60: RGB1.2 UBP1.26
$1N61: CB1.2 RB1.2 UBP1.27
$1N66: RTNC1.2 UBP1.8
$1N105: CTO2.2 UBP1.5
$1N106: CTO1.2 UBP1.4
$1N117: CTC1.1 UBP1.6
$1N128: CTC2.2 UBP1.7
$1N197: RDO1.1 UBP1.12
$1N523: QB4.1 RGB4.1
$1N524: QB3.1 RGB3.1
$1N525: QB1.1 RGB1.1
$1N526: QB2.1 RGB2.1
$1N12807: D1.1 RVC1.2
$1N12811: CVC1.1 RCI1.2 RDI1.2 RVC1.1 UBP1.16 UBP1.28
$1N14828: LED3.2 RL3.1
$1N14831: LED3.1 QB3.3 RBB6.1
$1N14846: LED4.2 RL4.1
$1N14849: LED4.1 QB4.3 RBB7.1
$1N14873: LED2.2 RL2.1
$1N14876: LED2.1 QB2.3 RBB5.1
$1N14882: LED1.2 RL1.1
$1N14886: LED1.1 QB1.3 RBB1.1
$1N21594: Q1.5 Q1.6 Q1.7 Q1.8 Q2.5 Q2.6 Q2.7 Q2.8 Q3.5 Q3.6 Q3.7 Q3.8 Q4.5 Q4.6 Q4.7 Q4.8 Q5.5 Q5.6 Q5.7 Q5.8 Q6.5 Q6.6 Q6.7 Q6.8
$1N21831: Q3.4 Q4.4 Q6.4 RDO1.2
$1N21844: CCS1.1 Q3.1 Q3.2 Q3.3 Q4.1 Q4.2 Q4.3 Q6.1 Q6.2 Q6.3 RCS1.1 RCS2.1 RS1.2 UBP1.14
$1N22030: Q1.4 Q2.4 Q5.4 RGL1.2 UBP1.11
$1N23729: CN16.1 R1.1 U2.1 U3.1 U4.1
$1N34990: LED5.2 R2.1

Pads without a net: UBP1 1 13 15 18

## Via types
v1: diameter 0.762, hole 0.308, Top Layer to Bottom Layer, 437 vias
v2: diameter 0.762, hole 0.3, Top Layer to Bottom Layer, 11 vias

## Routing (per net, layer and track width the routed paths; a pad name or vN(x,y) marks a point on that pad's centre or on a via; arc(x,y) is an arc through that point)
5V1: length 123.2
  Bottom Layer w2.54: v1(148.9,76) v1(147.9,76) v1(146.9,76) ; v1(55.4,18.9) v1(54.4,18.9) v1(53.4,18.9) ; v1(148.9,77) v1(147.9,77) v1(146.9,77) 116.3,77 59.2,19.9 v1(55.4,19.9) v1(54.4,19.9) v1(53.4,19.9)
5V2: length 82.2
  Top Layer w2.54: CN3.1 CN2.1 148.7,32.8 CN1.1 142.9,33.1
  Bottom Layer w2.54: v1(92.28,19.8) v1(92.28,18.8) v1(93.28,18.8) v1(93.28,19.8) v1(94.28,18.8) v1(94.28,19.8) 97.38,22.9 133.5,22.9 v1(142.9,32.3) v1(143.9,33.3) v1(144.9,33.3)
  vias: v1(142.9,33.3) v1(143.9,32.3) v1(144.9,32.3)
5V3: length 56.8
  Top Layer w2.54: v1(131.95,20.2) v1(132.95,20.2) v1(133.95,20.2) 167.7,20.2 170.5,23 CN6.1 CN7.1 185.29,25 CN8.1
  vias: v1(131.95,19.2) v1(132.95,19.2) v1(133.95,19.2)
5V4: length 81.8
  Bottom Layer w2.54: v1(82.9,95.1) v1(81.9,95.1) v1(80.9,95.1) ; v1(82.9,95.1) 102.8,95.1 110.4,87.5 132.37,87.5 138.17,81.7 153,81.7 CN11.1 ; v1(82.9,95.1) v1(82.9,96.1) v1(81.9,96.1) v1(80.9,96.1)
5V5: length 68.4
  Bottom Layer w1.52: 121.74,95.1 v1(121.64,95.2) v1(120.64,95.2) ; v1(120.64,96.2) v1(121.64,96.2) 121.74,96.1 ; v1(120.64,96.2) v1(119.64,96.2) ; v1(120.64,96.2) 120.74,96.1 ; v1(120.64,95.2) 120.74,95.1 ; v1(120.64,95.2) v1(119.64,95.2)
  Bottom Layer w2.54: CN10.1 182.18,88.4 155.6,88.4 147.8,96.2 v1(121.64,96.2)
5V6: length 23
  Top Layer w2.54: CN17.1 CN13.1 CN12.1 164.83,97.1 160.64,97.1 v1(160.24,96.7)
  vias: v1(158.24,96.7) v1(158.24,95.7) v1(159.24,96.7) v1(159.24,95.7) v1(160.24,95.7)
GND: length 371.4
  Top Layer w0.254: RVM1.1 3.25,39.2 RGL1.1 ; 1.7,35.9 0.6,37 0.81,106.81 2.9,108.9 8.5,108.9 10.3,107.1 CN16.2
  Bottom Layer w1.08: NOREF#22.32 223.1,4.4 219.9,1.2 191.6,1.2 185.6,7.2 116.2,7.2 110,1 4.1,1 v2(3.5,1.61) v2(2.67,2.43) v2(2,3.1)
VIN: length 25.1
  Top Layer w0.254: v2(173.8,19.2) 175.2,19.2 C1.2 175.62,19.3 182.07,19.3 R3.2
  Bottom Layer w0.254: v2(173.8,19.2) 163.9,19.2 160.7,22.4 160.7,24.3 v2(160.8,24.4)
AD_VIN: length 12
  Top Layer w0.254: CN18.2 CN18.1 184.53,14.33 C2.2 183.99,14.19 R4.2 181.5,16.42 R3.1
B1: length 37.8
  Bottom Layer w1.08: v1(37.9,38.4) v1(37.9,37.4) 29.2,37.4 v1(24.1,42.5) v1(23.4,43.2) 15.9,43.2 NOREF#29.30
B2: length 39.9
  Bottom Layer w1.08: NOREF#5.29 20.42,51.58 v1(23.9,51.58) v1(23.9,52.6) 32.32,52.6 v1(37.8,47.12) v1(37.8,48.2)
B3: length 38.8
  Bottom Layer w1.08: NOREF#4.4 21.17,60.63 v1(25.4,60.63) v1(25.4,61.7) 36.1,61.7 v1(37.9,59.9) v1(37.9,58.85)
B+: length 235.8
  Top Layer w0.254: 21.4,72.3 21.42,72.28 RB1.1 ; D1.2 18.6,72.4 18.5,72.5
  Bottom Layer w1.08: v2(38.4,103.8) v2(38.4,104.95) v2(38.4,106.05) 38.4,106.6 40.7,108.9 216.1,108.9 223.1,101.9 NOREF#20.31
B-: length 24.2
  Top Layer w0.254: v1(23.3,48.5) 22.58,49.22 CB3.1 ; CB1.1 21.53,67.4 v1(20,67.4) ; 16.87,46.37 17.31,45.94 17.31,37.51 ; 16.87,46.37 UBP1.17 ; 16.87,46.37 17.4,46.9 17.4,47.28 17.01,47.67 UBP1.19 ; QB4.2 25.55,32.94 v1(25.55,31.4) ; 17.31,37.51 18.19,37.51 v1(18.7,37) ; 17.31,37.51 CCS1.2 ; v1(24.6,56.6) 24.6,56.74 CB2.1 ; CVC1.2 16.09,59.4 v2(14.7,59.4) ; CB4.1 22.17,41.33 v1(23.3,40.2)
  vias: v1(1.9,59) v1(1.9,57.9) v1(1.9,56.83) v1(1.9,55.8) v1(1.9,54.77) v1(1.9,53.74) v1(1.9,52.71) v1(19.7,37) v1(20.69,37) v1(23.5,31.4) v1(24.53,31.4) v1(42.3,23.7) v1(42.3,22.7) v1(42.3,21.7) v1(42.3,20.7) v1(42.3,19.7) v1(42.3,18.7) v1(42.3,17.7) v1(42.3,16.7) v1(42.3,15.7) v1(42.3,14.7) v1(42.3,13.7) v1(42.3,12.7) v1(42.3,11.7) v1(42.3,10.7) v1(42.3,9.7) v1(42.3,8.7) v1(42.3,7.7) v1(42.3,6.7) v1(42.3,5.7) v1(42.3,4.7) v1(43.3,23.7) v1(43.3,22.7) v1(43.3,21.7) v1(43.3,20.7) v1(43.3,19.7) v1(43.3,18.7) v1(43.3,17.7) v1(43.3,16.7) v1(43.3,15.7) v1(43.3,14.7) v1(43.3,13.7) v1(43.3,12.7) v1(43.3,11.7) v1(43.3,10.7) v1(43.3,9.7) v1(43.3,8.7) v1(43.3,7.7) v1(43.3,6.7) v1(43.3,5.7) v1(43.3,4.7) v1(44.3,23.7) v1(44.3,22.7) v1(44.3,21.7) v1(44.3,20.7) v1(44.3,19.7) v1(44.3,18.7) v1(44.3,17.7) v1(44.3,16.7) v1(44.3,15.7) v1(44.3,14.7) v1(44.3,13.7) v1(44.3,12.7) v1(44.3,11.7) v1(44.3,10.7) v1(44.3,9.7) v1(44.3,8.7) v1(44.3,7.7) v1(44.3,6.7) v1(44.3,5.7) v1(44.3,4.7) v1(45.3,23.7) v1(45.3,22.7) v1(45.3,21.7) v1(45.3,20.7) v1(45.3,19.7) v1(45.3,18.7) v1(45.3,17.7) v1(45.3,16.7) v1(45.3,15.7) v1(45.3,14.7) v1(45.3,13.7) v1(45.3,12.7) v1(45.3,11.7) v1(45.3,10.7) v1(45.3,9.7) v1(45.3,8.7) v1(45.3,7.7) v1(45.3,6.7) v1(45.3,5.7) v1(45.3,4.7) v1(46.3,23.7) v1(46.3,22.7) v1(46.3,21.7) v1(46.3,20.7) v1(46.3,19.7) v1(46.3,18.7) v1(46.3,17.7) v1(46.3,16.7) v1(46.3,15.7) v1(46.3,14.7) v1(46.3,13.7) v1(46.3,12.7) v1(46.3,11.7) v1(46.3,10.7) v1(46.3,9.7) v1(46.3,8.7) v1(46.3,7.7) v1(46.3,6.7) v1(46.3,5.7) v1(46.3,4.7) v1(47.3,23.7) v1(47.3,22.7) v1(47.3,21.7) v1(47.3,20.7) v1(47.3,19.7) v1(47.3,18.7) v1(47.3,17.7) v1(47.3,16.7) v1(47.3,15.7) v1(47.3,14.7) v1(47.3,13.7) v1(47.3,12.7) v1(47.3,11.7) v1(47.3,10.7) v1(47.3,9.7) v1(47.3,8.7) v1(47.3,7.7) v1(47.3,6.7) v1(47.3,5.7) v1(47.3,4.7) v1(195.4,17.5) v1(195.4,16.5) v1(195.4,15.5) v1(195.4,14.5) v1(195.4,13.5) v1(196.4,17.5) v1(196.4,16.5) v1(196.4,15.5) v1(196.4,14.5) v1(196.4,13.5) v1(197.4,17.5) v1(197.4,16.5) v1(197.4,15.5) v1(197.4,14.5) v1(197.4,13.5) v1(198.4,17.5) v1(198.4,16.5) v1(198.4,15.5) v1(198.4,14.5) v1(198.4,13.5) v1(199.4,17.5) v1(199.4,16.5) v1(199.4,15.5) v1(199.4,14.5) v1(199.4,13.5) v1(200.4,17.5) v1(200.4,16.5) v1(200.4,15.5) v1(200.4,14.5) v1(200.4,13.5) v1(202.3,17.6) v1(202.3,16.6) v1(202.3,15.6) v1(202.3,14.6) v1(202.3,13.6) v1(203.3,17.6) v1(203.3,16.6) v1(203.3,15.6) v1(203.3,14.6) v1(203.3,13.6) v1(204.3,17.6) v1(204.3,16.6) v1(204.3,15.6) v1(204.3,14.6) v1(204.3,13.6) v1(204.5,104) v1(204.5,103) v1(204.5,102) v1(204.5,101) v1(204.5,100) v1(204.48,98.46) v1(204.48,97.46) v1(204.48,96.46) v1(204.48,95.46) v1(204.48,94.46) v1(205.3,17.6) v1(205.3,16.6) v1(205.3,15.6) v1(205.3,14.6) v1(205.3,13.6) v1(205.5,104) v1(205.5,103) v1(205.5,102) v1(205.5,101) v1(205.5,100) v1(205.48,98.46) v1(205.48,97.46) v1(205.48,96.46) v1(205.48,95.46) v1(205.48,94.46) v1(206.3,17.6) v1(206.3,16.6) v1(206.3,15.6) v1(206.3,14.6) v1(206.3,13.6) v1(206.5,104) v1(206.5,103) v1(206.5,102) v1(206.5,101) v1(206.5,100) v1(206.48,98.46) v1(206.48,97.46) v1(206.48,96.46) v1(206.48,95.46) v1(206.48,94.46) v1(207.3,17.6) v1(207.3,16.6) v1(207.3,15.6) v1(207.3,14.6) v1(207.3,13.6) v1(207.5,104) v1(207.5,103) v1(207.5,102) v1(207.5,101) v1(207.5,100) v1(207.48,98.46) v1(207.48,97.46) v1(207.48,96.46) v1(207.48,95.46) v1(207.48,94.46) v1(208.5,104) v1(208.5,103) v1(208.5,102) v1(208.5,101) v1(208.5,100) v1(208.48,98.46) v1(208.48,97.46) v1(208.48,96.46) v1(208.48,95.46) v1(208.48,94.46) v1(209,17.5) v1(209,16.5) v1(209,15.5) v1(209,14.5) v1(209,13.5) v1(209.5,104) v1(209.5,103) v1(209.5,102) v1(209.5,101) v1(209.5,100) v1(209.48,98.46) v1(209.48,97.46) v1(209.48,96.46) v1(209.48,95.46) v1(209.48,94.46) v1(210,17.5) v1(210,16.5) v1(210,15.5) v1(210,14.5) v1(210,13.5) v1(211,17.5) v1(211,16.5) v1(211,15.5) v1(211,14.5) v1(211,13.5) v1(211.5,104) v1(211.5,103) v1(211.5,102) v1(211.5,101) v1(211.5,100) v1(211.48,98.32) v1(211.48,97.32) v1(211.48,96.32) v1(211.48,95.32) v1(211.48,94.32) v1(212,17.5) v1(212,16.5) v1(212,15.5) v1(212,14.5) v1(212,13.5) v1(212.5,104) v1(212.5,103) v1(212.5,102) v1(212.5,101) v1(212.5,100) v1(212.48,98.32) v1(212.48,97.32) v1(212.48,96.32) v1(212.48,95.32) v1(212.48,94.32) v1(213,17.5) v1(213,16.5) v1(213,15.5) v1(213,14.5) v1(213,13.5) v1(213.5,104) v1(213.5,103) v1(213.5,102) v1(213.5,101) v1(213.5,100) v1(213.48,98.32) v1(213.48,97.32) v1(213.48,96.32) v1(213.48,95.32) v1(213.48,94.32) v1(214,17.5) v1(214,16.5) v1(214,15.5) v1(214,14.5) v1(214,13.5) v1(214.5,104) v1(214.5,103) v1(214.5,102) v1(214.5,101) v1(214.5,100) v1(214.48,98.32) v1(214.48,97.32) v1(214.48,96.32) v1(214.48,95.32) v1(214.48,94.32) v1(215.5,104) v1(215.5,103) v1(215.5,102) v1(215.5,101) v1(215.5,100) v1(215.48,98.32) v1(215.48,97.32) v1(215.48,96.32) v1(215.48,95.32) v1(215.48,94.32) v1(215.8,17.5) v1(215.8,16.5) v1(215.8,15.5) v1(215.8,14.5) v1(215.8,13.5) v1(216.5,104) v1(216.5,103) v1(216.5,102) v1(216.5,101) v1(216.5,100) v1(216.48,98.32) v1(216.48,97.32) v1(216.48,96.32) v1(216.48,95.32) v1(216.48,94.32) v1(216.8,17.5) v1(216.8,16.5) v1(216.8,15.5) v1(216.8,14.5) v1(216.8,13.5) v1(217.8,17.5) v1(217.8,16.5) v1(217.8,15.5) v1(217.8,14.5) v1(217.8,13.5) v1(218.8,17.5) v1(218.8,16.5) v1(218.8,15.5) v1(218.8,14.5) v1(218.8,13.5) v1(219.8,17.5) v1(219.8,16.5) v1(219.8,15.5) v1(219.8,14.5) v1(219.8,13.5) v1(220.8,17.5) v1(220.8,16.5) v1(220.8,15.5) v1(220.8,14.5) v1(220.8,13.5)
$1N37: length 6.3
  Top Layer w0.254: RTRH1.2 6.45,45.25 9.52,48.32 UBP1.9
$1N38: length 7.8
  Top Layer w0.254: RVM1.2 5.25,43.35 9.57,47.67 UBP1.10
$1N41: length 9
  Top Layer w0.254: RCI1.1 13.1,59.08 13.1,54 11.32,52.22 10.28,52.22
$1N42: length 8.7
  Top Layer w0.254: RDI1.1 10.01,59.1 11,59.1 11.5,58.6 11.5,53.4 10.97,52.87 UBP1.2
$1N54: length 12
  Top Layer w0.254: RGB4.2 18.4,40.12 18.4,46.93 17.01,48.32 UBP1.20
$1N55: length 9.8
  Top Layer w0.254: UBP1.21 16.93,48.97 18.9,47 18.9,44.96 RB4.2 CB4.2
$1N56: length 5.2
  Top Layer w0.254: UBP1.22 17.1,49.62 RGB3.2
$1N57: length 7.9
  Top Layer w0.254: UBP1.23 18.02,50.27 RB3.2 20.01,49.28 CB3.2
$1N58: length 7.2
  Top Layer w0.254: 16.02,50.92 16.82,50.92 21.15,55.25 RGB2.2
$1N59: length 11.5
  Top Layer w0.254: RB2.2 CB2.2 20.1,56.6 20.1,54.9 16.77,51.57 UBP1.25
$1N60: length 13.6
  Top Layer w0.254: RGB1.2 19.4,61.11 19.4,54.9 16.72,52.22 16.02,52.22
$1N61: length 22.4
  Top Layer w0.254: RB1.2 23.56,70.41 CB1.2 23.56,65.86 23.3,65.6 21.3,65.6 19.7,64 19.7,62.4 18.4,61.1 18.4,54.58 16.7,52.87 UBP1.27
$1N66: length 5.4
  Top Layer w0.254: RTNC1.2 8.33,48.01 9.29,48.97 UBP1.8
$1N105: length 8.1
  Top Layer w0.254: CTO2.2 8.1,53.49 8.1,52.1 9.28,50.92 10.28,50.92
$1N106: length 10.6
  Top Layer w0.254: UBP1.4 9.23,51.57 8.5,52.3 8.5,54.1 6.4,56.2 6.4,58.29 CTO1.2
$1N117: length 6.4
  Top Layer w0.254: CTC1.1 5.91,53.49 9.1,50.3 10.26,50.3 UBP1.6
$1N128: length 5.5
  Top Layer w0.254: CTC2.2 8.05,50.75 9.18,49.62 UBP1.7
$1N197: length 8.8
  Top Layer w0.254: UBP1.12 9.57,46.37 9.1,45.9 9.1,38.56 RDO1.1
$1N523: length 5.1
  Top Layer w0.254: RGB4.1 21.99,38.4 QB4.1
$1N524: length 4.8
  Top Layer w0.254: RGB3.1 25.05,43.68 QB3.1
$1N525: length 4.3
  Top Layer w0.254: RGB1.1 24.2,63.91 24.2,65.1 24.74,65.64 QB1.1
$1N526: length 2.5
  Top Layer w0.254: QB2.1 24.51,54.16 RGB2.1
$1N12807: length 1.9
  Top Layer w0.254: 18.47,68.25 18.55,68.16 RVC1.2
$1N12811: length 29.7
  Top Layer w0.254: RVC1.1 18.5,64.31 18.5,62.3 17.54,61.34 ; 17.54,61.34 CVC1.1 RCI1.2 RDI1.2 ; 17.54,61.34 17.54,55.05 16.02,53.52 15.02,53.52 14.8,53.3 14.8,45.9 14.98,45.72 UBP1.16
$1N14828: length 2.5
  Top Layer w0.254: LED3.2 39.69,44.63 RL3.1
$1N14831: length 9.3
  Top Layer w0.254: LED3.1 35.8,42.2 32.5,45.5 29.89,45.5 RBB6.1
$1N14846: length 2.7
  Top Layer w0.254: RL4.1 39.74,32.89 LED4.2
$1N14849: length 8.9
  Top Layer w0.254: LED4.1 32.52,36.73 RBB7.1
$1N14873: length 4.6
  Top Layer w0.254: LED2.2 40.33,55.87 39.94,56.26
$1N14876: length 10.6
  Top Layer w0.254: LED2.1 36.26,51.84 31.56,56.54 RBB5.1
$1N14882: length 3.2
  Top Layer w0.254: LED1.2 37.73,62.37 RL1.1
$1N14886: length 5.5
  Top Layer w0.254: LED1.1 30.14,64.69 QB1.3
$1N21831: length 45.2
  Top Layer w0.254: 23.2,13.21 22.7,12.71 22.7,5.9 23,5.61 Q6.4 ; 23.2,13.21 22.6,13.8 22.6,19.53 23.15,20.09 Q3.4 23.4,20.99 23.4,24 17.4,30 17.4,33.1 13.1,37.4 10.9,37.4 10.01,36.51 RDO1.2 ; 23.2,13.21 Q4.4
$1N21844: length 34.1
  Top Layer w0.254: 26.2,19.5 26.2,23 18.5,30.7 18.5,34.16 CCS1.1 14.15,38.51 RS1.2 12.1,38.66 12.1,44.6 11.63,45.07 UBP1.14
$1N22030: length 60
  Top Layer w0.254: 8,9.4 8.9,8.5 8.9,2.4 8.39,1.89 Q5.4 ; 8,9.4 8.5,9.9 8.5,15.9 8.1,16.3 7.04,16.3 Q2.4 7.76,16.37 9,17.6 v2(9.7,17.6) ; 8,9.4 6.85,9.4 Q1.4 ; v2(4.1,39.8) 5.39,38.51 RGL1.2 6.1,38.66 6.1,43.53 9.59,47.02 UBP1.11
  Bottom Layer w0.254: v2(4.1,39.8) 4.3,39.6 4.3,23.9 9.7,18.5 v2(9.7,17.6)
$1N23729: length 84.7
  Top Layer w0.254: 47.7,78.2 46.9,77.4 44.89,77.4 U4.1 ; 47.7,78.2 47.7,69.5 46.9,68.7 44.98,68.7 U2.1 ; 47.7,78.2 47.7,85.5 46.85,86.35 U3.1 47.6,89.18 47.6,107.2 45.98,108.82 R1.1 31.44,108.7 13.6,108.7 CN16.1
$1N34990: length 2.8
  Top Layer w0.254: R2.1 178.66,14.46 LED5.2

## Copper pours and planes (outline as drawn; the poured copper is in the pictures)
5V1 on Top Layer: 146.4,78.1 153.3,78.1 155.2,76.2 155.2,72.6 154.9,72.3 147.9,72.3 146.3,73.9 146.3,78
GND on Top Layer: 0.5,37.1 6.9,37.1 7.2,36.8 7.2,36.2 8.1,35.3 10.2,35.3 10.6,35.7 10.6,36.29 11.34,37.03 11.36,37.01 12.95,37.01 16.7,33.25 16.7,24.2 15.4,22.9 10.6,22.9 8.9,21.2 8.9,17.6 8.7,17.4 5.9,17.4 5.5,17 5.5,15.5 6.48,14.52 8.06,14.52 8.28,14.3 8.3,14.3 8.28,14.28 8.28,10.23 8.05,10 5.3,10 4.8,9.5 4.8,8.2 5.1,7.9 7.6,7.9 8.3,7.2 8.3,2.87 8.07,2.64 6.04,2.64 5.5,2.1 5.5,0.6 5.2,0.3 2.3,0.3 0.4,2.2 0.4,37
VIN on Top Layer: 48.2,86.8 49.9,88.5 49.9,93.4 53.6,93.4 54.2,92.8 54.2,90.5 56.7,88 87.6,88 89.8,90.2 89.8,93.3 91.6,93.3 92.9,92 92.9,88.8 93.6,88.1 125.7,88.1 127.1,89.5 127.1,92.8 127.8,93.5 130.4,93.5 133.4,90.5 133.4,29.1 134.5,28 162.9,28 164.7,26.2 164.7,22.3 164.3,21.9 161.8,21.9 161.6,22.1 160.7,22.1 160,22.8 127.5,22.8 126.6,21.9 121.9,21.9 120.5,23.3 120.5,26.3 87.8,26.3 87,25.5 87,23.1 85.6,21.7 83,21.7 82.3,22.4 82.3,25.71 82.01,26 50.7,26 48.2,28.5
B1 on Top Layer: 22.37,42.93 23.6,41.7 23.6,40.9 26.2,40.9 26.4,41.1 26.4,42.8 26.3,42.9 25,42.9 22.9,45 21.3,45 21.3,42.93
B1 on Top Layer: 35.2,39.3 41.8,39.3 41.8,35.9 35.2,35.9
B2 on Top Layer: 35,49.1 41.4,49.1 41.4,46 35,46
B2 on Top Layer: 21.6,53.4 26.07,53.4 26.49,52.98 26.49,50.79 26.1,50.4 21.6,50.4 21.4,50.6 21.4,53.2
B3 on Top Layer: 25.3,64.2 24.4,63.3 24.4,61.6 22.67,61.6 22.42,61.35 22.42,59.58 22.7,59.3 26.6,59.3 26.7,59.4 26.7,64.19 25.3,64.19
B3 on Top Layer: 34.8,60.8 41.22,60.8 41.22,57.26 34.8,57.26
B+ on Top Layer: 6.63,103.8 14.3,103.8 18.1,107.6 39.2,107.6 42.7,104.1 42.7,85.7 43.5,84.9 46.2,84.9 47,84.1 47,79.7 46,78.7 41.7,78.7 41.1,77.6 41.85,76.2 46.3,76.2 46.8,75.7 46.8,71.2 46.2,70.6 41.9,70.6 40.9,69.6 40.9,68 41.6,67.3 46.2,67.3 47.5,66 47.5,63.06 46.63,62.19 40.11,62.19 38.83,63.47 36.33,63.47 34.5,65.3 34.5,69.4 33.6,70.3 28.3,70.3 26.9,71.7 9.7,71.7 6.4,75 6.4,103.6 6.5,103.7
B- on Top Layer: 1.31,60.5 3.9,60.5 4.06,60.34 4.06,44.76 3.6,44.3 1.4,44.3 1.1,44.6 1.1,60.29
B- on Top Layer: 18.6,37.4 21.7,37.4 24.2,34.9 24.8,33.39 25.64,33.39 27.8,30 31.2,30 33.4,27.8 35.9,27.8 36.9,26.8 36.9,24.8 35.6,23.5 27.3,23.5 18.9,31.9 18.9,34.9 18.11,35.69 18.11,36.91
B- on Top Layer: 36.6,27.8 44.8,27.8 49.8,22.8 49.8,18.6 51.1,17.3 173.72,17.3 174.05,17.64 176.54,17.64 177.3,16.88 177.3,13.6 177.66,13.24 186.74,13.24 190.4,16.9 190.4,26.9 189.4,27.9 169.4,27.9 168.3,29 168.3,32.9 165.1,36.1 139,36.1 134.1,41 134.1,71.85 135.82,73.56 144.74,73.56 147.9,70.4 155.6,70.4 156.1,70.9 156.1,82.63 158.57,85.1 185.2,85.1 185.3,85.2 185.3,100.3 183.7,101.9 165.1,101.9 162.4,99.2 51.5,99.2 49.3,101.4 49.3,108 50.5,109.2 215.5,109.2 221.4,103.3 221.4,4.1 217.9,0.6 191.1,0.6 185.4,6.3 116.5,6.3 110.9,0.7 34.6,0.7 33.1,2.2 33.1,26.8 34,27.7
B- on Bottom Layer: 1.3,69.1 41.4,69.1 41.4,31.36 1.3,31.36
$1N14831 on Top Layer: 26.8,48.1 31,48.1 31,40.4 26.8,40.4
$1N14849 on Top Layer: 27.1,38.9 31,38.9 31,31.5 27.1,31.5
$1N14876 on Top Layer: 26.8,58.7 30.6,58.7 30.6,51.5 26.8,51.5
$1N14886 on Top Layer: 27,69.9 30.1,69.9 30.1,63.4 27,63.4
$1N21594 on Top Layer: 11.3,22.3 19.8,22.3 19.8,0.5 11.3,0.5
$1N21844 on Top Layer: 31.2,0.7 23.3,0.7 22.6,1.4 22.6,4.38 23.05,4.83 25.43,4.83 25.8,5.2 25.8,6.3 25.6,6.5 23.5,6.5 23.1,6.9 23.1,12.2 23.4,12.5 25.6,12.5 25.8,12.7 25.8,13.7 25.4,14.1 23.6,14.1 23.2,14.5 23.2,19.3 23.5,19.6 25.8,19.6 25.8,22.62 30.49,22.62 31.5,19 31.5,1

Small or netless copper shapes (teardrops, artwork), in the pictures only: 2 on Top Layer, 1 on Bottom Layer

## Text on the board
Bottom Silkscreen Layer: + | - | 电池组1 | 电池组2 | 电池组3 | 电池组4
Top Silkscreen Layer: GND | B+ | B- | 5V6 | 树莓派 | PH计 | 上位机 | 下位机 | 后推进器 | 右推进器 | 左推进器 | 机械臂 | 矢量舵机 | 电量检测模块 | TPS计 | 主控板 | 充电模块 | 云台 | 5V拓展2 | 5V拓展1 | 缓启动开关 | 海驭001
